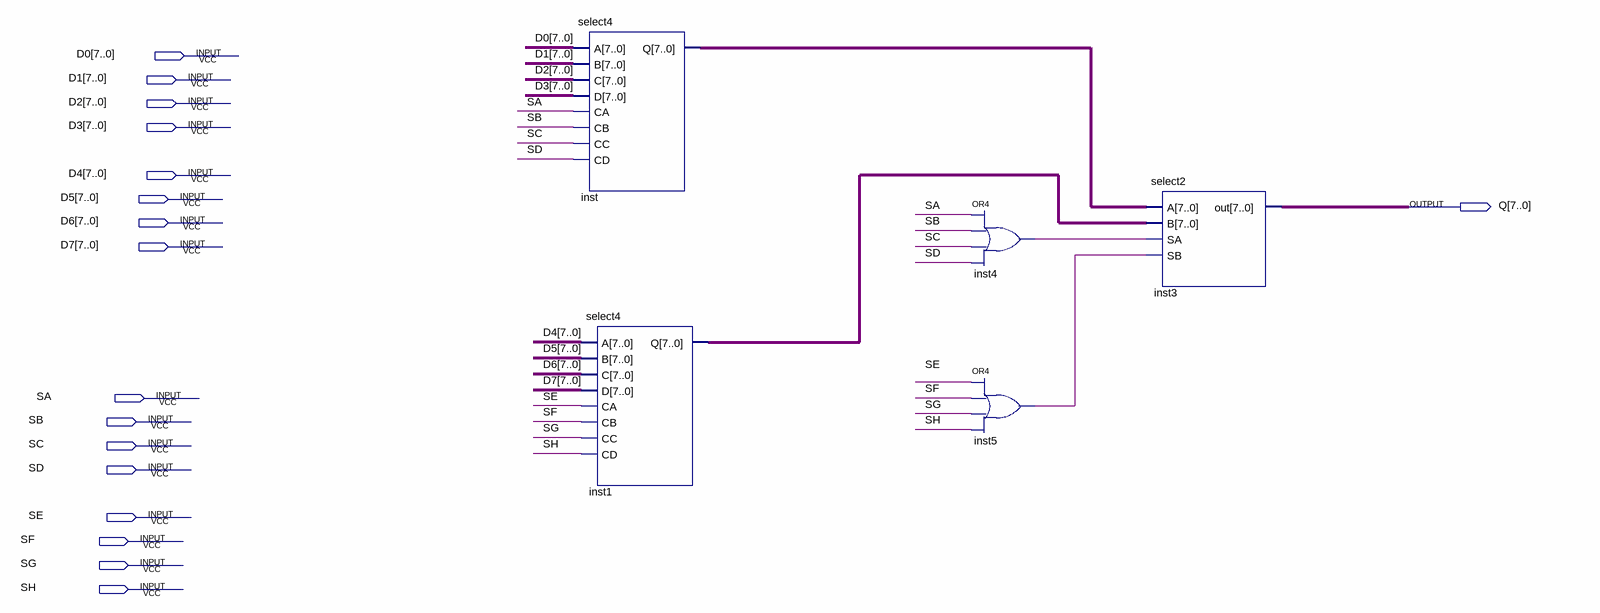
[diagram p0: schematic sheet]
// Quartus schematic select8.bdf as structural Verilog: 5 symbols, 17 pins
module select8 (
  input  [7:0] D0,
  input  [7:0] D1,
  input  [7:0] D2,
  input  [7:0] D3,
  input  [7:0] D4,
  input  [7:0] D5,
  input  [7:0] D6,
  input  [7:0] D7,
  input  SA,
  input  SB,
  input  SC,
  input  SD,
  input  SE,
  input  SF,
  input  SG,
  input  SH,
  output [7:0] Q
);

  wire inst4_out, inst5_out;
  wire [7:0] inst1_q, inst_q;

  select4 inst (.A(D0), .B(D1), .C(D2), .D(D3), .CA(SA), .CB(SB), .CC(SC), .CD(SD), .Q(inst_q));
  select4 inst1 (.A(D4), .B(D5), .C(D6), .D(D7), .CA(SE), .CB(SF), .CC(SG), .CD(SH), .Q(inst1_q));
  or inst4 (inst4_out, SA, SB, SC, SD);
  or inst5 (inst5_out, SE, SF, SG, SH);
  select2 inst3 (.A(inst_q), .B(inst1_q), .SA(inst4_out), .SB(inst5_out), .out(Q));
endmodule
